# EAGLE design DietSquirt (EAGLE 7.1.0)
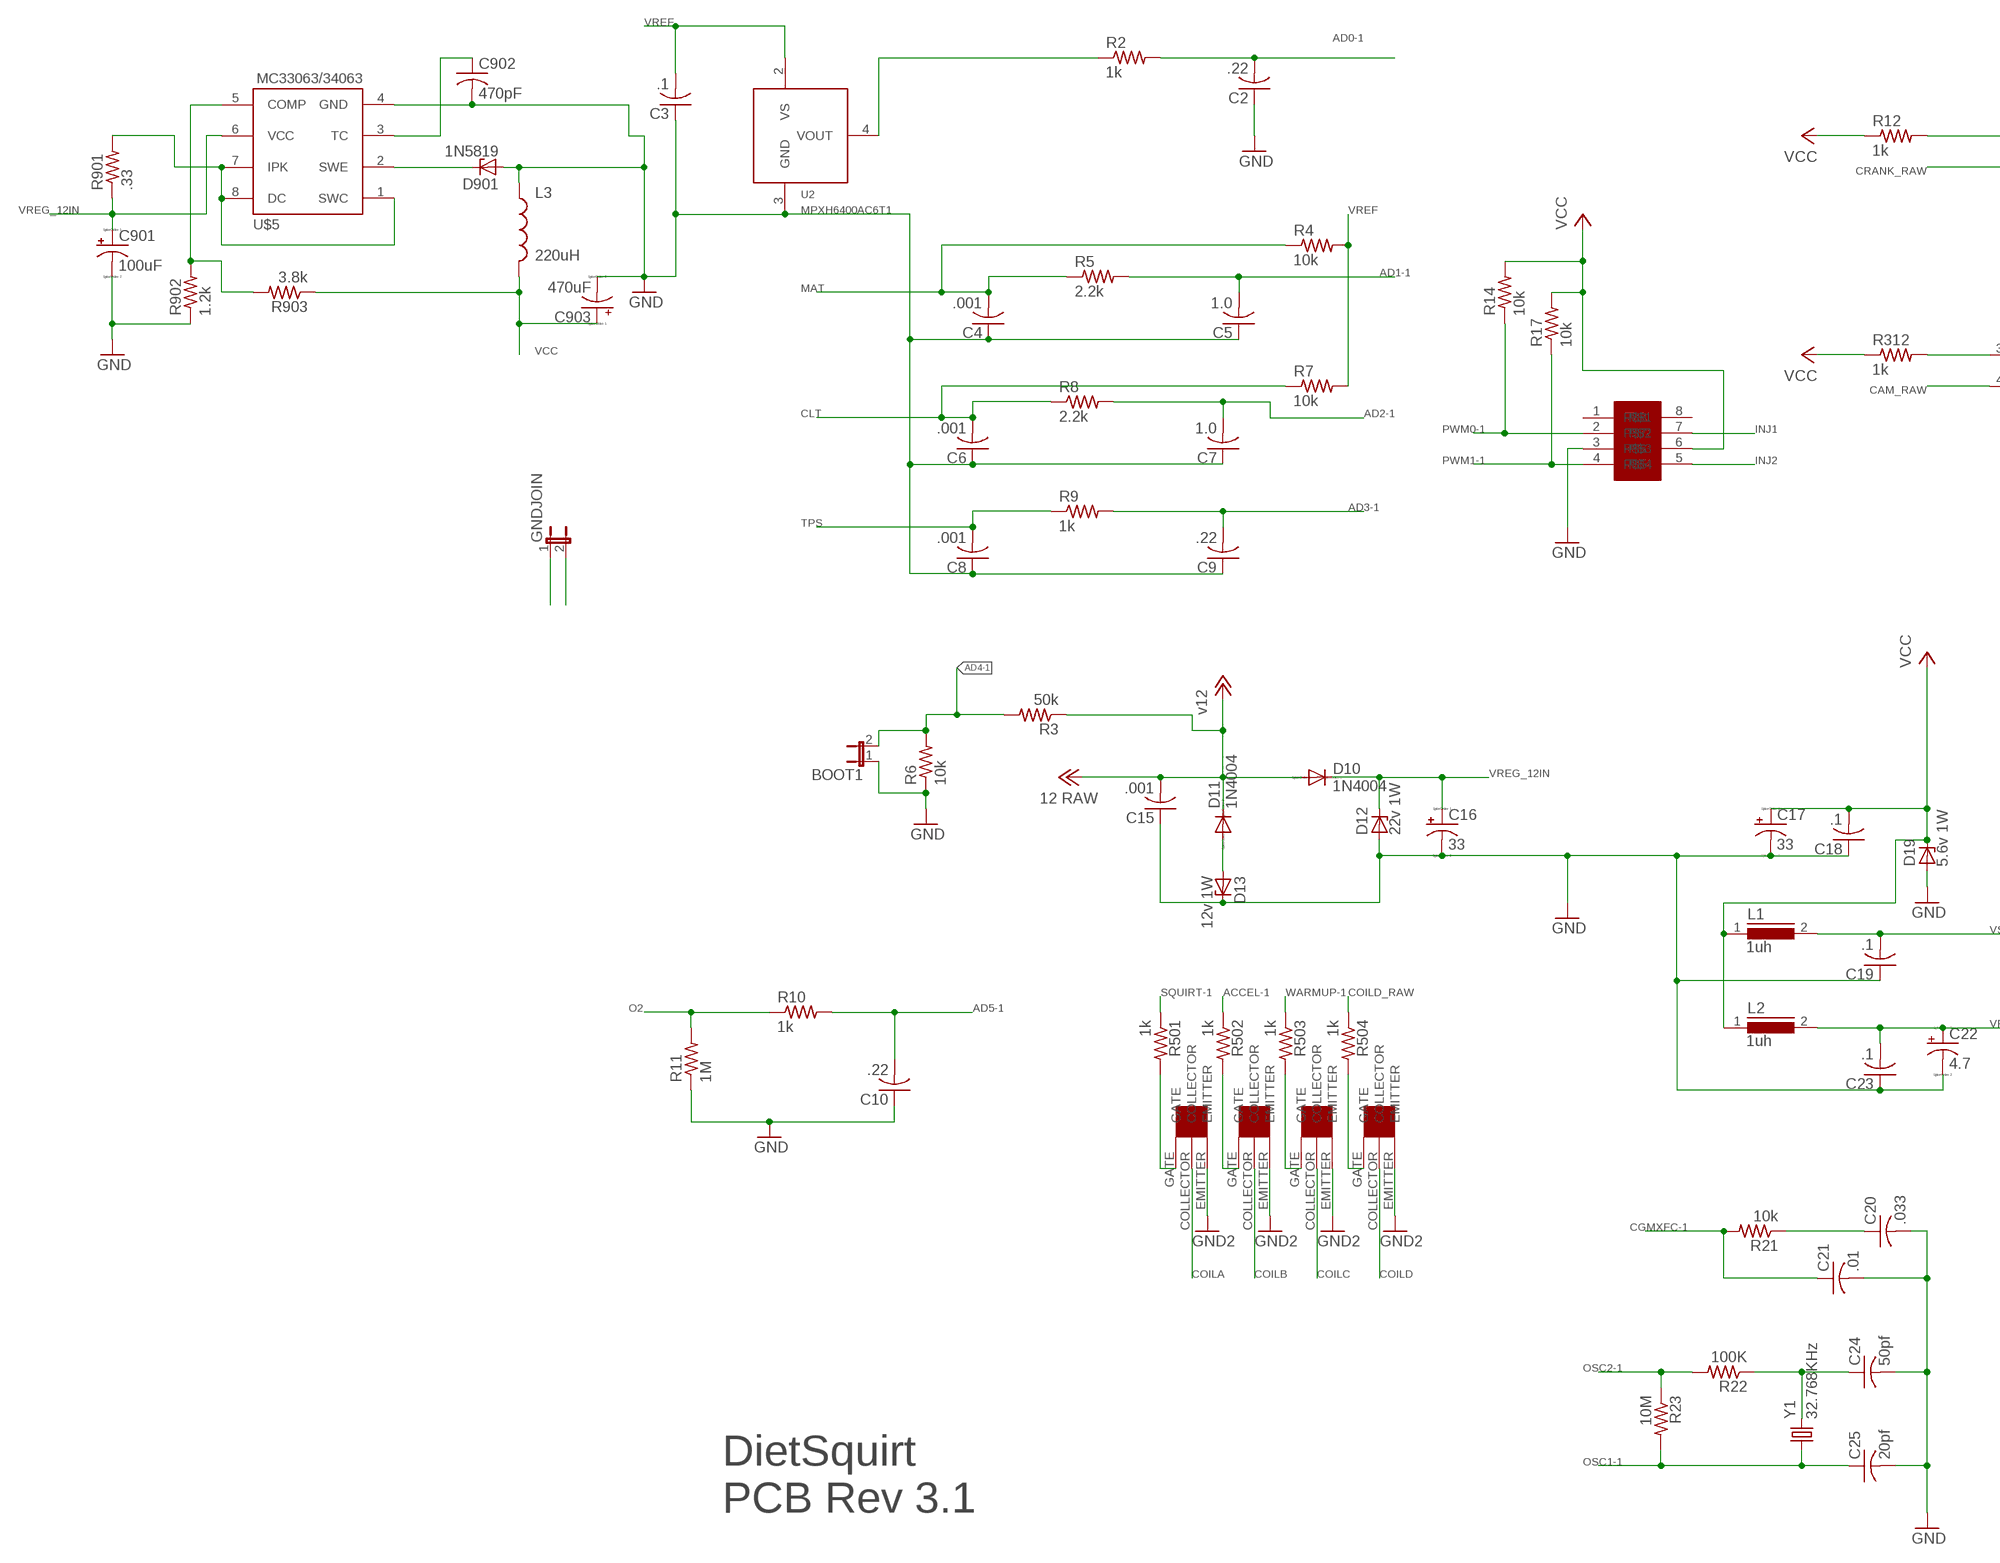
[diagram p0: schematic, sheet 1, part 1 of 2]
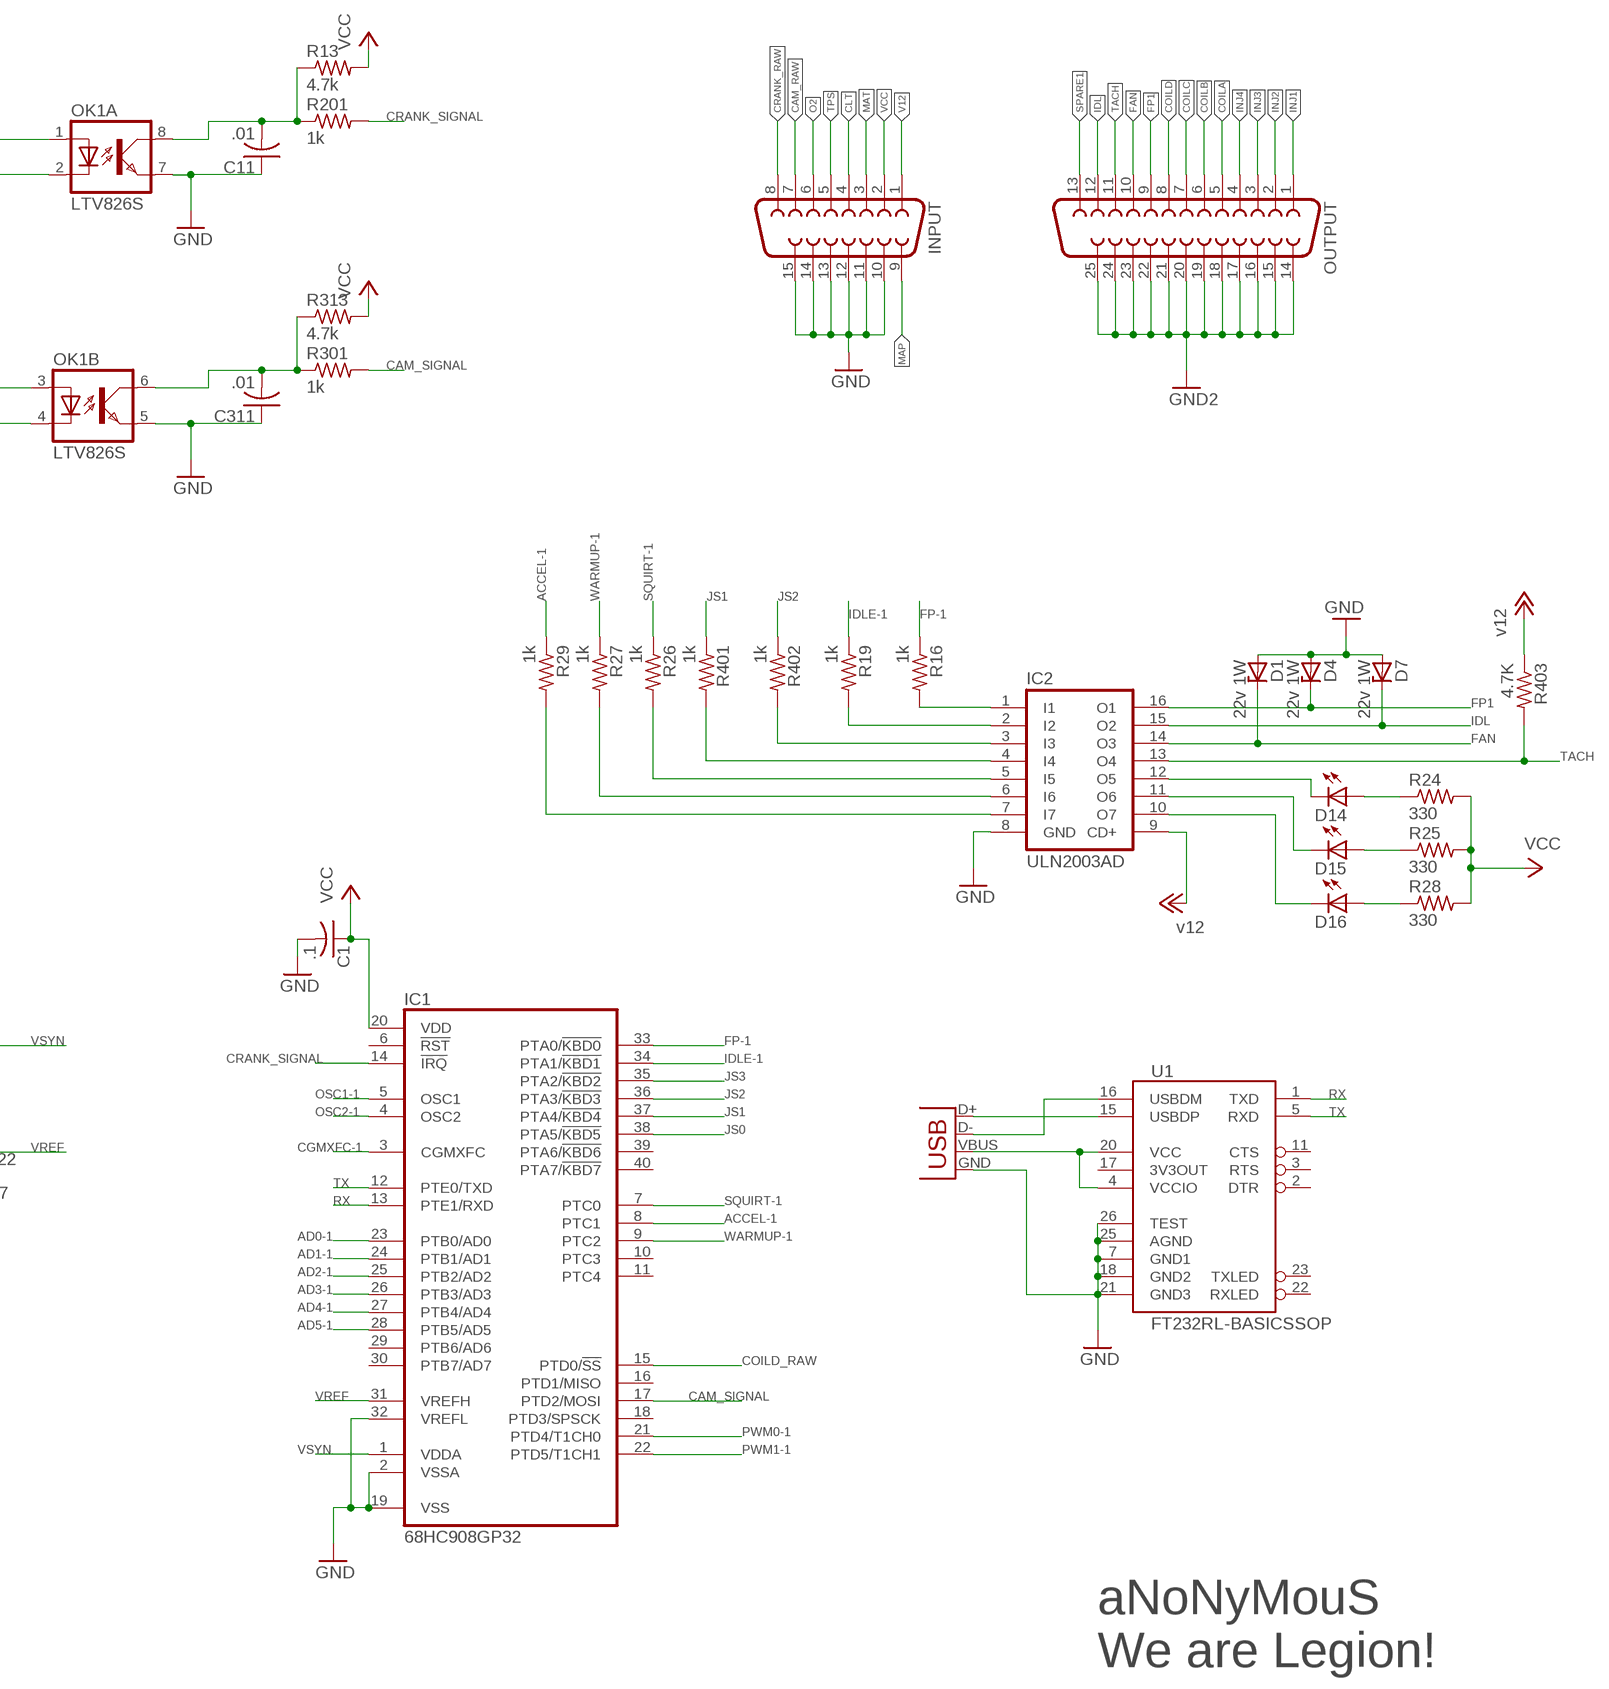
[diagram p1: schematic, sheet 1, part 2 of 2]

## Parts
BOOT1  JUMPER-2PTH  [1X02]
C1  .1  C-USC0805  [C0805]
C2  .22  C-USC0805  [C0805]
C3  .1  C-USC0805  [C0805]
C4  .001  C-USC0805  [C0805]
C5  1.0  C-USC0805  [C0805]
C6  .001  C-USC0805  [C0805]
C7  1.0  C-USC0805  [C0805]
C8  .001  C-USC0805  [C0805]
C9  .22  C-USC0805  [C0805]
C10  .22  C-USC0805  [C0805]
C11  .01  C-USC0805  [C0805]
C15  .001  C-USC0805  [C0805]
C16  33  CPOL-USC/6032-28R  [C/6032-28R]
C17  33  CPOL-USC/6032-28R  [C/6032-28R]
C18  .1  C-USC0805  [C0805]
C19  .1  C-USC0805  [C0805]
C20  .033  C-USC0805  [C0805]
C21  .01  C-USC0805  [C0805]
C22  4.7  CPOL-USC/6032-28R  [C/6032-28R]
C23  .1  C-USC0805  [C0805]
C24  50pf  C-USC0805  [C0805]
C25  20pf  C-USC0805  [C0805]
C311  .01  C-USC0805  [C0805]
C901  100uF  CPOL-USC/6032-28R  [C/6032-28R]
C902  470pF  C-USC0805  [C0805]
C903  470uF  CPOL-USC/6032-28R  [C/6032-28R]
COILA  ISL9V3036S3ST  [TO263]
COILB  ISL9V3036S3ST  [TO263]
COILC  ISL9V3036S3ST  [TO263]
COILD  ISL9V3036S3ST  [TO263]
D1  22v 1W  ZPY  [DO41Z10]
D4  22v 1W  ZPY  [DO41Z10]
D7  22v 1W  ZPY  [DO41Z10]
D10  1N4004  [DO41-10]
D11  1N4004  [DO41-10]
D12  22v 1W  ZPY  [DO41Z10]
D13  12v 1W  ZPY  [DO41Z10]
D14  LEDCHIPLED_0805  [CHIPLED_0805]
D15  LEDCHIPLED_0805  [CHIPLED_0805]
D16  LEDCHIPLED_0805  [CHIPLED_0805]
D19  5.6v 1W  ZPY  [DO41Z10]
D901  1N5819  ZPY  [DO41Z10]
GNDJOIN  JUMPER-2PTH  [1X02]
IC1  68HC908GP32  [DIL40]
IC2  ULN2003AD  [SO16]
INPUT  F15H  [F15H]
L1  1uh  MICC12  [MICC12]
L2  1uh  MICC12  [MICC12]
L3  220uH  INDUCTORNPI75  [NPI75C]
OK1  LTV826S  [DIL8-SMD]
OUTPUT  F25H  [F25H]
R2  1k  R-US_R0805  [R0805]
R3  50k  R-US_R0805  [R0805]
R4  10k  R-US_R0805  [R0805]
R5  2.2k  R-US_R0805  [R0805]
R6  10k  R-US_R0805  [R0805]
R7  10k  R-US_R0805  [R0805]
R8  2.2k  R-US_R0805  [R0805]
R9  1k  R-US_R0805  [R0805]
R10  1k  R-US_R0805  [R0805]
R11  1M  R-US_R0805  [R0805]
R12  1k  R-US_R0805  [R0805]
R13  4.7k  R-US_R0805  [R0805]
R14  10k  R-US_R0805  [R0805]
R16  1k  R-US_R0805  [R0805]
R17  10k  R-US_R0805  [R0805]
R19  1k  R-US_R0805  [R0805]
R21  10k  R-US_R0805  [R0805]
R22  100K  R-US_R0805  [R0805]
R23  10M  R-US_R0805  [R0805]
R24  330  R-US_R0805  [R0805]
R25  330  R-US_R0805  [R0805]
R26  1k  R-US_R0805  [R0805]
R27  1k  R-US_R0805  [R0805]
R28  330  R-US_R0805  [R0805]
R29  1k  R-US_R0805  [R0805]
R201  1k  R-US_R0805  [R0805]
R301  1k  R-US_R0805  [R0805]
R312  1k  R-US_R0805  [R0805]
R313  4.7k  R-US_R0805  [R0805]
R401  1k  R-US_R0805  [R0805]
R402  1k  R-US_R0805  [R0805]
R403  4.7K  R-US_R0805  [R0805]
R501  1k  R-US_R0805  [R0805]
R502  1k  R-US_R0805  [R0805]
R503  1k  R-US_R0805  [R0805]
R504  1k  R-US_R0805  [R0805]
R901  .33  R-US_R0805  [R0805]
R902  1.2k  R-US_R0805  [R0805]
R903  3.8k  R-US_R0805  [R0805]
U1  FT232RL-BASICSSOP  [SSOP28DB]
U2  MPXH6400AC6T1  [SSOP8]
U$1  MC34151  [SO08]
U$5  MC33063/MC34063D  [SO08]
X1  USB-MICROB  [USB-MICROB]
Y1  32.768KHz  CRYSTALTC26H  [TC26H]

## Nets
+12V: IC2.9(CD+) R403.1 ; supply symbol labelled v12
ACCEL-1: IC1.8(PTC1) R29.1 R502.1
AD0-1: C2.2 IC1.23(PTB0/AD0) R2.2
AD1-1: C5.2 IC1.24(PTB1/AD1) R5.2
AD2-1: C7.2 IC1.25(PTB2/AD2) R8.2
AD3-1: C9.2 IC1.26(PTB3/AD3) R9.2
AD4-1: BOOT1.2 IC1.27(PTB4/AD4) R3.2 R6.2
AD5-1: C10.2 IC1.28(PTB5/AD5) R10.2
CAM_RAW: INPUT.7 OK1.4(B:C)
CAM_SIGNAL: IC1.17(PTD2/MOSI) R301.2
CGMXFC-1: C21.1 IC1.3(CGMXFC) R21.2
CLT: C6.2 INPUT.4 R7.1 R8.1
COILA: COILA.COLLECTOR OUTPUT.5
COILB: COILB.COLLECTOR OUTPUT.6
COILC: COILC.COLLECTOR OUTPUT.7
COILD: COILD.COLLECTOR OUTPUT.8
COILD_RAW: IC1.15(PTD0/!SS) R504.1
CRANK_RAW: INPUT.8 OK1.2(A:C)
CRANK_SIGNAL: IC1.14(!IRQ) R201.2
FAN: D1.C IC2.14(O3) OUTPUT.10
FP1: D4.C IC2.16(O1) OUTPUT.9
FP-1: IC1.33(PTA0/!KBD0) R16.1
GND: BOOT1.1 C1.2 C2.1 C3.1 C4.1 C5.1 C6.1 C7.1 C8.1 C9.1 C10.1 C11.1 C15.1 C16.- C17.- C18.1 C19.1 C20.2 C21.2 C22.- C23.1 C24.2 C25.2 C311.1 C901.- C902.2 C903.- D1.A D4.A D7.A D12.A D13.C D19.A D901.A GNDJOIN.1 IC1.2(VSSA) IC1.19(VSS) IC1.32(VREFL) IC2.8(GND) INPUT.10 INPUT.11 INPUT.12 INPUT.13 INPUT.14 INPUT.15 L3.1 OK1.5(B:EMIT) OK1.7(A:EMIT) R6.1 R11.1 R902.1 U1.7(GND1) U1.18(GND2) U1.21(GND3) U1.25(AGND) U1.26(TEST) U2.3(GND) U$1.3 U$5.4(GND) X1.GND
GND2: COILA.EMITTER COILB.EMITTER COILC.EMITTER COILD.EMITTER GNDJOIN.2 OUTPUT.14 OUTPUT.15 OUTPUT.16 OUTPUT.17 OUTPUT.18 OUTPUT.19 OUTPUT.20 OUTPUT.21 OUTPUT.22 OUTPUT.23 OUTPUT.24 OUTPUT.25
IDL: D7.C IC2.15(O2) OUTPUT.12
IDLE-1: IC1.34(PTA1/!KBD1) R19.1
INJ1: OUTPUT.1 U$1.7
INJ2: OUTPUT.2 U$1.5
INJ3: OUTPUT.3
INJ4: OUTPUT.4
JS0: IC1.38(PTA5/!KBD5)
JS1: IC1.37(PTA4/!KBD4) R401.1
JS2: IC1.36(PTA3/!KBD3) R402.1
JS3: IC1.35(PTA2/!KBD2)
MAP: INPUT.9 R2.1 U2.4(VOUT)
MAT: C4.2 INPUT.3 R4.1 R5.1
N$1: C24.1 R22.1 Y1.2
N$2: OK1.1(A:A) R12.2
N$4: C20.1 R21.1
N$5: OK1.3(B:A) R312.2
N$6: D11.A D13.A
N$7: IC2.1(I1) R16.2
N$8: IC2.2(I2) R19.2
N$9: C11.2 OK1.8(A:COL) R13.1 R201.1
N$10: C311.2 OK1.6(B:COL) R301.1 R313.1
N$11: U1.4(VCCIO) U1.20(VCC) X1.VBUS
N$14: D901.C U$5.2(SWE)
N$15: IC2.3(I3) R402.2
N$16: U1.16(USBDM) X1.D-
N$17: U1.15(USBDP) X1.D+
N$18: IC2.4(I4) R401.2
N$19: IC2.5(I5) R26.2
N$20: IC2.6(I6) R27.2
N$21: IC2.7(I7) R29.2
N$22: D14.C IC2.12(O5)
N$23: D15.C IC2.11(O6)
N$24: D16.C IC2.10(O7)
N$25: D16.A R28.1
N$26: D15.A R25.1
N$27: D14.A R24.1
N$28: COILA.GATE R501.2
N$30: COILB.GATE R502.2
N$31: COILC.GATE R503.2
N$32: R901.2 U$5.1(SWC) U$5.7(IPK) U$5.8(DC)
N$34: R902.2 R903.2 U$5.5(COMP)
N$35: COILD.GATE R504.2
N$36: C902.1 U$5.3(TC)
O2: INPUT.6 R10.1 R11.2
OSC1-1: C25.1 IC1.5(OSC1) R23.2 Y1.1
OSC2-1: IC1.4(OSC2) R22.2 R23.1
PWM0-1: IC1.21(PTD4/T1CH0) R14.1 U$1.2
PWM1-1: IC1.22(PTD5/T1CH1) R17.1 U$1.4
RX: IC1.13(PTE1/RXD) U1.1(TXD)
SPARE1: OUTPUT.13
SQUIRT-1: IC1.7(PTC0) R26.1 R501.1
TACH: IC2.13(O4) OUTPUT.11 R403.2
TPS: C8.2 INPUT.5 R9.1
TX: IC1.12(PTE0/TXD) U1.5(RXD)
V12: C15.2 D10.A D11.C INPUT.1 R3.1 ; supply symbol labelled v12, 12 RAW
VCC: C1.1 C17.+ C18.2 C903.+ D19.C IC1.20(VDD) INPUT.2 L1.1 L2.1 L3.2 R12.1 R13.2 R14.2 R17.2 R24.2 R25.2 R28.2 R312.1 R313.2 R903.1 U$1.6
VREF: C3.2 C22.+ C23.2 IC1.31(VREFH) L2.2 R4.2 R7.2 U2.2(VS)
VREG_12IN: C16.+ C901.+ D10.C D12.C R901.1 U$5.6(VCC)
VSYN: C19.2 IC1.1(VDDA) L1.2
WARMUP-1: IC1.9(PTC2) R27.1 R503.1
Unconnected: IC1.6(!RST) IC1.10(PTC3) IC1.11(PTC4) IC1.16(PTD1/MISO) IC1.18(PTD3/SPSCK) IC1.29(PTB6/AD6) IC1.30(PTB7/AD7) IC1.39(PTA6/!KBD6) IC1.40(PTA7/!KBD7) U1.2(DTR) U1.3(RTS) U1.11(CTS) U1.17(3V3OUT) U1.22(RXLED) U1.23(TXLED) U2.1(NC) U2.5(NC) U2.6(NC) U2.7(NC) U2.8(NC) U$1.1 U$1.8

## Notes on the sheet
- aNoNyMouS
  We are Legion!
- DietSquirt
  PCB Rev 3.1

## Library data of the parts
BOOT1 GNDJOIN = SparkFun:JUMPER-2: Jumper Basic 0.1" spaced jumper. Use with breakaway headers.
C1-C11 C15 C18-C21 C23-C25 C311 C902 = resistor:C-US: CAPACITOR, American symbol
C16 C17 C22 C901 C903 = resistor:CPOL-US: POLARIZED CAPACITOR, American symbol
COILA COILB COILC COILD = IGBT:ISL9V3036S3ST
D1 D4 D7 D12 D13 D19 D901 = diode:ZPY: Z DIODE 1 W
D10 D11 = diode:1N4004: DIODE general purpose rectifier, 1 A
D14-D16 = adafruit:LED: LED OSRAM: - CHIPLED LG R971, LG N971, LY N971, LG Q971, LY Q971, LO R971, LY R971 LH N974, LH R974 LS Q976, LO Q976, LY Q976 LO Q996 - Hyper CHIPLED LW Q18S LB Q993, LB Q99A, LB R99A - SideLED LS A670, LO A670, LY A670, LG A670, LP A670 LB A673, LV A673, LT A673, LW A673 LH A674 LY A675 LS A676, LA A676, LO A676, LY A676, LW A676 LS A679, LY A679, LG A679 - Hyper Micro SIDELED® LS Y876, LA Y876, LO Y876, LY Y876 LT Y87S - SmartLED LW L88C, LW L88S LB L89C, LB L89S, LG L890 LS L89K, LO L89K, LY L89K LS L896, LA L896, LO L896, LY L896 - TOPLED LS T670, LO T670, LY T670, LG T670, LP T670 LSG T670, LSP T670, LSY T670, LOP T670, LYG T670 LG T671, LOG T671, LSG T671 LB T673, LV T673, LT T673, LW T673 LH T674 LS T676, LA T676, LO T676, LY T676, LB T676, LH T676, LSB T676, LW T676 LB T67C, LV T67C, LT T67C, LS T67K, LO T67K, LY T67K, LW E67C LS E67B, LA E67B, LO E67B, LY E67B, LB E67C, LV E67C, LT E67C LW T67C LS T679, LY T679, LG T679 LS T770, LO T770, LY T770, LG T770, LP T770 LB T773, LV T773, LT T773, LW T773 LH T774 LS E675, LA E675, LY E675, LS T675 LS T776, LA T776, LO T776, LY T776, LB T776 LHGB T686 LT T68C, LB T68C - Hyper Mini TOPLED® LB M676 - Mini TOPLED Santana® LG M470 LS M47K, LO M47K, LY M47K Source: http://www.osram.convergy.de/
IC1 = micro-motorola:68HC908GP32*: MC68HC908GP32 MC68HC08GP32 Source: www.motorola.com .. MC68HC908GP32.pdf; MF: MOTOROLA; MPN: MC68HC908GP32CP; OC_FARNELL: 1200519; OC_NEWARK: 95B4407
IC2 = uln-udn:ULN2003A: DRIVER ARRAY
INPUT = con-subd:F15: SUB-D; OC_FARNELL: unknown; OC_NEWARK: unknown
L1 L2 = inductors:MICC12: INDUCTOR
L3 = SparkFun:INDUCTOR: Inductors Basic Inductor/Choke - 0603 and 1206. Footprints are not proven and vary greatly between part numbers.
OK1 = optocoupler:LTV826: OPTO COUPLER Source: LITEON, LTV816.pdf; OC_FARNELL: unknown; OC_NEWARK: unknown
OUTPUT = con-subd:F25: SUB-D; OC_FARNELL: unknown; OC_NEWARK: unknown
R2-R14 R16 R17 R19 R21-R29 R201 R301 R312 R313 R401-R403 R501-R504 R901-R903 = rcl:R-US_: RESISTOR, American symbol
U1 = SparkFun:FT232RL-BASIC: USB UART This is the simplified version of the FT232RL unit. Only what you need, nothing you don't. Spark Fun Electronics SKU : COM-00650
U2 = mpxh6400:MPXH6400A
U$1 = mc34151:MC34151
U$5 = adafruit:MC33063/MC34063: MC33063 and MC34063 Basic DC/DC converter with internal power-NPN transistor, 100KHz, 1.5A peak switch current. 3-40 input/output.
X1 = SparkFun:USB: USB Connectors USB-B-PTH is fully proven SKU : PRT-00139 USB-miniB is fully proven SKU : PRT-00587 USB-A-PCB is untested. USB-A-H is throughly reviewed, but untested. Spark Fun Electronics SKU : PRT-00437 USB-B-SMT is throughly reviewed, but untested. Needs silkscreen touching up. USB-A-S has not been used/tested USB-MB-H has not been used/tested
Y1 = crystal:CRYSTAL: CRYSTAL; OC_FARNELL: unknown; OC_NEWARK: unknown

## Board
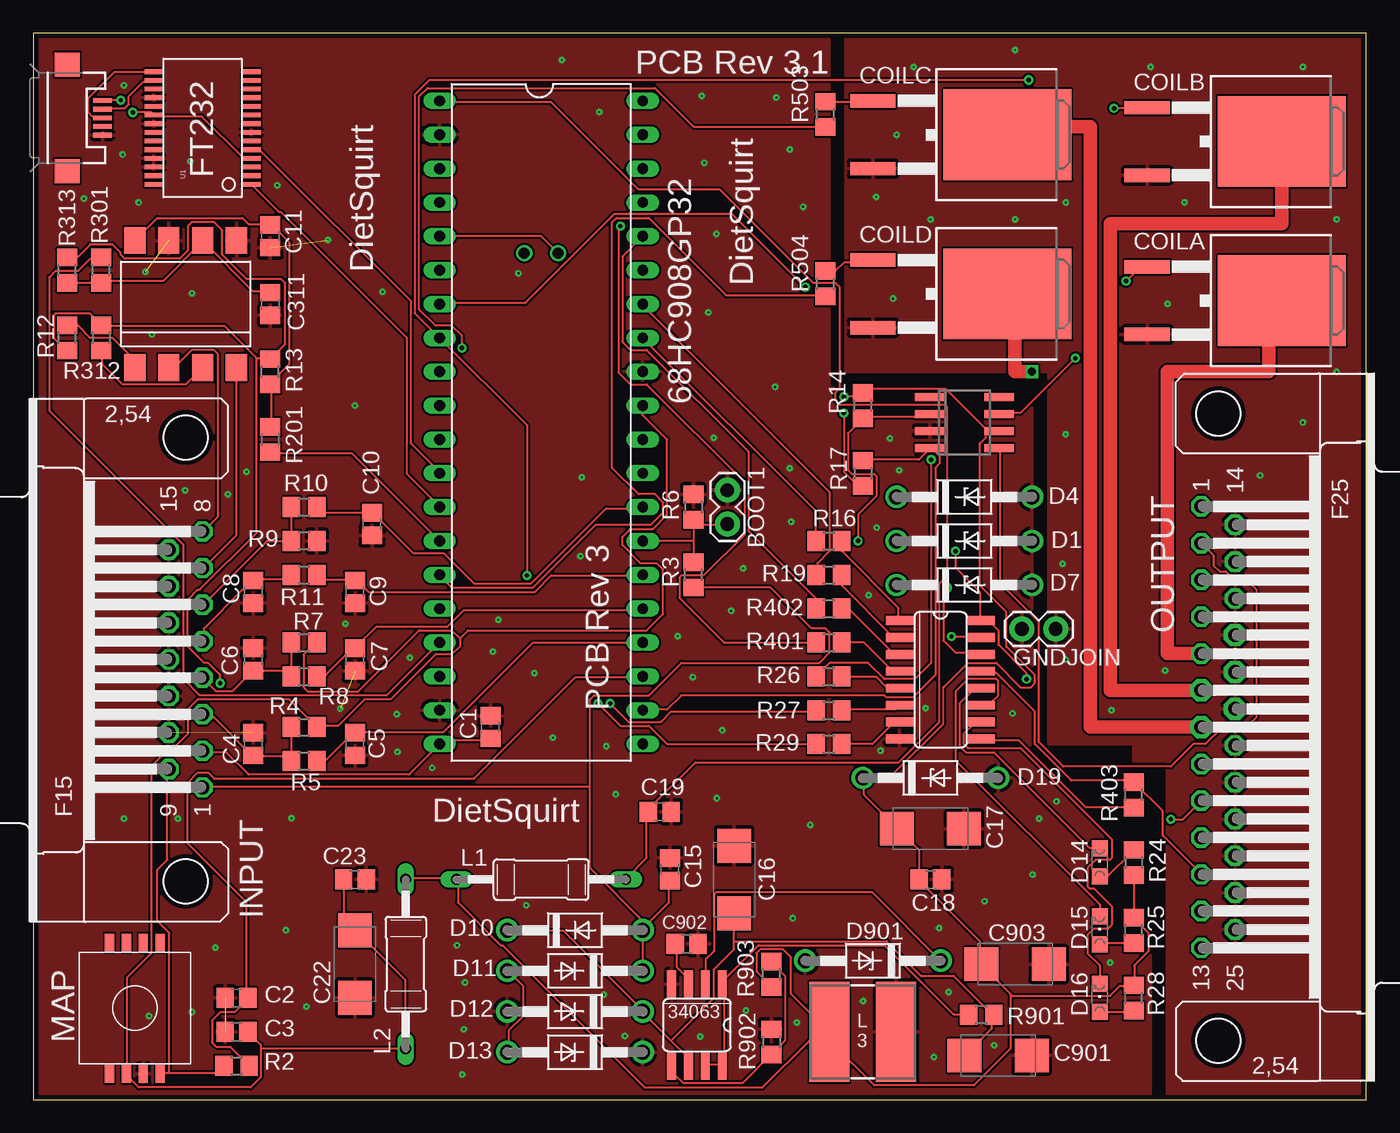
[diagram p2: board, top side]
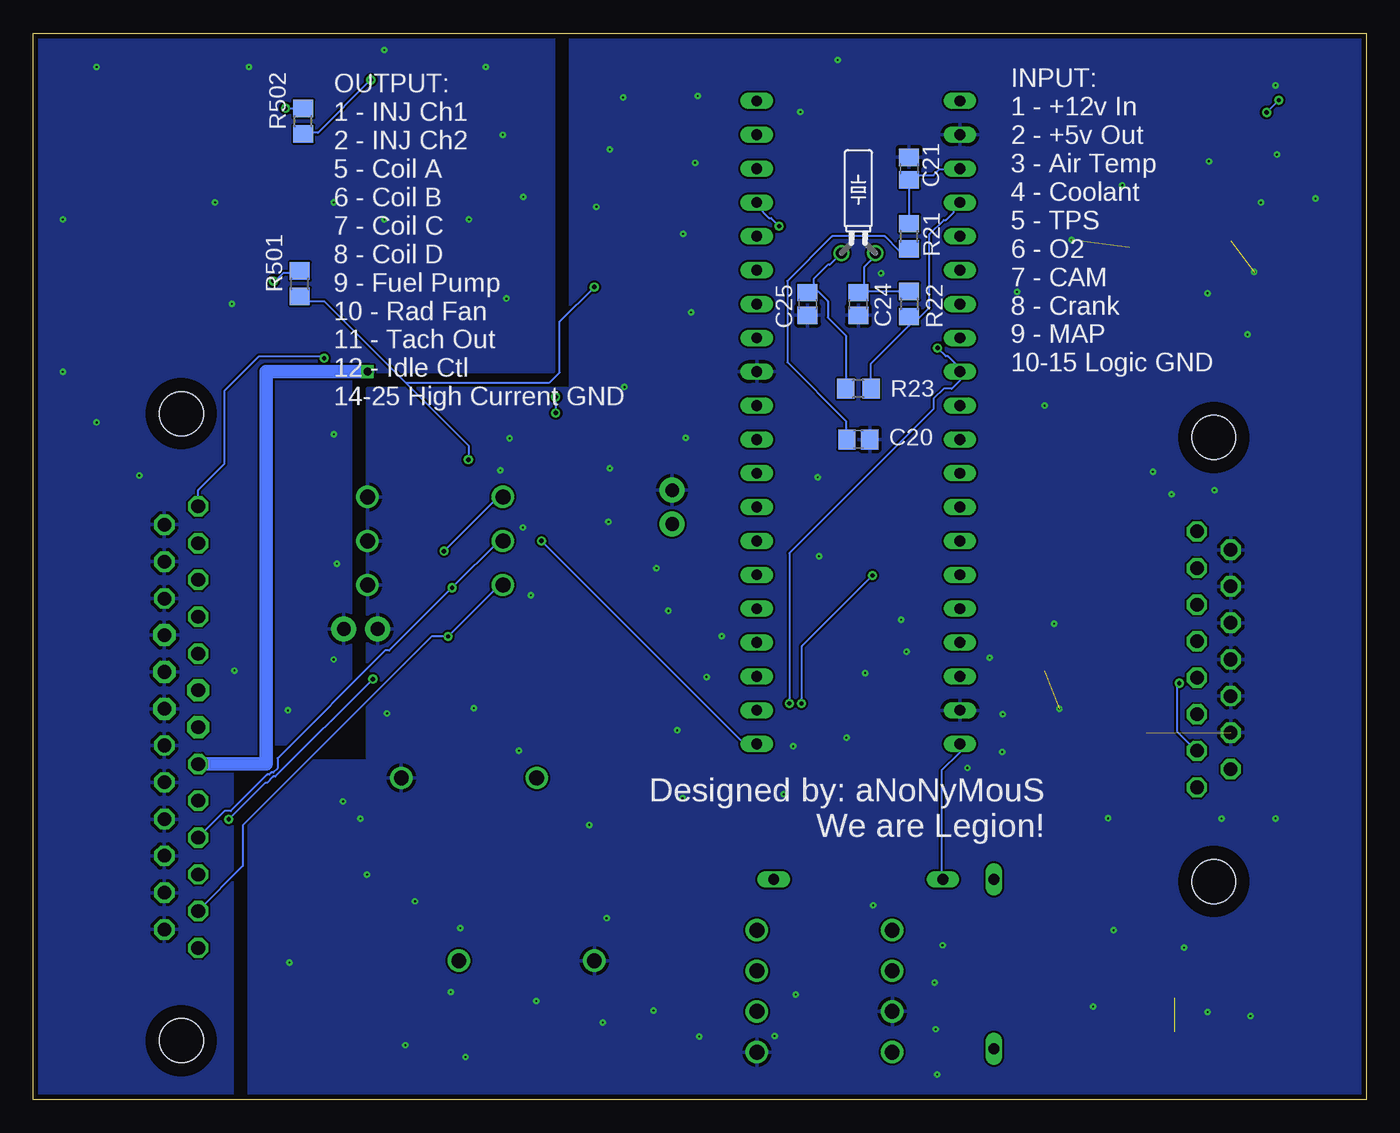
[diagram p3: board, bottom side, seen from below]

Size 100 x 80 mm. Coordinates in mm from the lower left corner, seen from the top.
Outline: 0,0 100,0 100,80 0,80 0,0
Copper layers (1*16): Top 0.0356mm / dielectric 1.5011mm / Bottom 0.0356mm
Design rules "oshpark-2layer *": minimum track width 6mil, minimum drill 13mil, track to track 6mil, track to pad 6mil, pad to pad 6mil, via to via 6mil, smd to smd 6mil, copper to edge 15mil, drill to drill 6mil, minimum pad ring 7mil, minimum via ring 7mil, stop-mask expansion 3mil, vias tented up to drill 25mil, thermal gap 10mil

### Footprints (pad centres in the part's own frame; a part is rotated, then mirrored left to right if it is on the bottom)
1X02 = drill 1.016 pad 1.88: 1 0,0; 2 2.54,0
C0805 = smd 1.3 x 1.5: 1 -0.85,0; 2 0.85,0
C/6032-28R = smd 2.55 x 2.5: + 2.525,0; - -2.525,0
TO263 = smd 6.8 x 9.6: COLLECTOR 0,3.5 | smd 1 x 3.4: EMITTER 2.54,-6.6; GATE -2.54,-6.6
DO41Z10 = drill 1.118: A 5.08,0; C -5.08,0
DO41-10 = drill 1.118: A 5.08,0; C -5.08,0
CHIPLED_0805 = smd 1.2 x 1.2: A 0,-1.05; C 0,1.05
DIL40 = drill 0.813 long: 1 -24.13,-7.62; 2 -21.59,-7.62; 3 -19.05,-7.62; 4 -16.51,-7.62; 5 -13.97,-7.62; 6 -11.43,-7.62; 7 -8.89,-7.62; 8 -6.35,-7.62; 9 -3.81,-7.62; 10 -1.27,-7.62; 11 1.27,-7.62; 12 3.81,-7.62; 13 6.35,-7.62; 14 8.89,-7.62; 15 11.43,-7.62; 16 13.97,-7.62; 17 16.51,-7.62; 18 19.05,-7.62; 19 21.59,-7.62; 20 24.13,-7.62; 21 24.13,7.62; 22 21.59,7.62; 23 19.05,7.62; 24 16.51,7.62; 25 13.97,7.62; 26 11.43,7.62; 27 8.89,7.62; 28 6.35,7.62; 29 3.81,7.62; 30 1.27,7.62; 31 -1.27,7.62; 32 -3.81,7.62; 33 -6.35,7.62; 34 -8.89,7.62; 35 -11.43,7.62; 36 -13.97,7.62; 37 -16.51,7.62; 38 -19.05,7.62; 39 -21.59,7.62; 40 -24.13,7.62
SO16 = smd 0.66 x 2.032: 1 -4.445,-3.073; 2 -3.175,-3.073; 3 -1.905,-3.073; 4 -0.635,-3.073; 5 0.635,-3.073; 6 1.905,-3.073; 7 3.175,-3.073; 8 4.445,-3.073; 9 4.445,3.073; 10 3.175,3.073; 11 1.905,3.073; 12 0.635,3.073; 13 -0.635,3.073; 14 -1.905,3.073; 15 -3.175,3.073; 16 -4.445,3.073
F15H = drill 1.016 octagon: 1 -9.601,-1.27; 2 -6.858,-1.27; 3 -4.115,-1.27; 4 -1.372,-1.27; 5 1.372,-1.27; 6 4.115,-1.27; 7 6.858,-1.27; 8 9.601,-1.27; 9 -8.23,1.27; 10 -5.486,1.27; 11 -2.743,1.27; 12 0,1.27; 13 2.743,1.27; 14 5.486,1.27; 15 8.23,1.27 | hole 3.302: -16.662,0; 16.662,0
MICC12 = drill 0.813 long: 1 -6.35,0; 2 6.35,0
NPI75C = smd 3 x 7.5: 1 -2.5,0; 2 2.5,0
DIL8-SMD = smd 1.6 x 2: 1 -3.81,-4.77; 2 -1.27,-4.77; 3 1.27,-4.77; 4 3.81,-4.77; 5 3.81,4.77; 6 1.27,4.77; 7 -1.27,4.77; 8 -3.81,4.77
F25H = drill 1.016 octagon: 1 -16.561,-1.27; 2 -13.792,-1.27; 3 -11.049,-1.27; 4 -8.28,-1.27; 5 -5.512,-1.27; 8 2.769,-1.27; 9 5.512,-1.27; 10 8.28,-1.27; 11 11.049,-1.27; 12 13.792,-1.27; 13 16.561,-1.27; 14 -15.189,1.27; 15 -12.421,1.27; 16 -9.652,1.27; 20 1.372,1.27; 21 4.14,1.27; 22 6.909,1.27; 23 9.652,1.27; 24 12.421,1.27; 25 15.189,1.27 | drill 1.016 pad 1.67 octagon: 6 -2.769,-1.27; 7 0,-1.27; 17 -6.909,1.27; 18 -4.14,1.27; 19 -1.372,1.27 | hole 3.302: -23.52,0; 23.52,0
R0805 = smd 1.3 x 1.5: 1 -0.95,0; 2 0.95,0
SSOP28DB = smd 0.348 x 1.397: 1 -4.225,-3.656; 2 -3.575,-3.656; 3 -2.925,-3.656; 4 -2.275,-3.656; 5 -1.625,-3.656; 6 -0.975,-3.656; 7 -0.325,-3.656; 8 0.325,-3.656; 9 0.975,-3.656; 10 1.625,-3.656; 11 2.275,-3.656; 12 2.925,-3.656; 13 3.575,-3.656; 14 4.225,-3.656; 15 4.225,3.656; 16 3.575,3.656; 17 2.925,3.656; 18 2.275,3.656; 19 1.625,3.656; 20 0.975,3.656; 21 0.325,3.656; 22 -0.325,3.656; 23 -0.975,3.656; 24 -1.625,3.656; 25 -2.275,3.656; 26 -2.925,3.656; 27 -3.575,3.656; 28 -4.225,3.656
SSOP8 = smd 1.346 x 0.686: 1 4.915,-1.905; 2 4.915,-0.635; 3 4.915,0.635; 4 4.915,1.905; 5 -4.915,1.905; 6 -4.915,0.635; 7 -4.915,-0.635; 8 -4.915,-1.905
SO08 = smd 0.6 x 2.2: 1 -1.905,-2.6; 2 -0.635,-2.6; 3 0.635,-2.6; 4 1.905,-2.6; 5 1.905,2.6; 6 0.635,2.6; 7 -0.635,2.6; 8 -1.905,2.6
SO08' = smd 0.66 x 2.032: 1 -1.905,-3.073; 2 -0.635,-3.073; 3 0.635,-3.073; 4 1.905,-3.073; 5 1.905,3.073; 6 0.635,3.073; 7 -0.635,3.073; 8 -1.905,3.073
USB-MICROB = smd 0.35 x 1.4: D+ 0,2.65; D- -0.65,2.65; GND 1.3,2.65; ID 0.65,2.65; VBUS -1.3,2.65 | smd 1.8 x 1.9: MT1 -4,0; MT2 4,0
TC26H = drill 0.813: 1 -1.27,0; 2 1.27,0

### Placement (x,y rotation side)
BOOT1  52.07,45.72 270 top
C1  34.29,27.94 90 top
C2  15.24,7.62 0 top
C3  15.24,5.08 0 top
C4  16.51,26.67 270 top
C5  24.13,26.67 90 top
C6  16.51,33.02 270 top
C7  24.13,33.02 90 top
C8  16.51,38.1 90 top
C9  24.13,38.1 90 top
C10  25.4,43.18 90 top
C11  17.78,64.77 90 top
C15  47.75,17.27 270 top
C16  52.58,16.51 270 top
C17  67.31,20.32 180 top
C18  67.31,16.51 180 top
C19  46.99,21.59 180 top
C20  38.1,49.53 0 bottom
C21  34.29,69.85 90 bottom
C22  24.13,10.16 90 top
C23  24.13,16.51 180 top
C24  38.1,59.69 270 bottom
C25  41.91,59.69 270 bottom
C311  17.78,59.69 90 top
C901  72.39,3.3 180 top
C902  49.02,11.68 0 top
C903  73.66,10.16 180 top
COILA  90.17,59.94 270 top
COILB  90.17,71.88 270 top
COILC  69.6,72.39 270 top
COILD  69.6,60.45 270 top
D1  69.85,41.91 0 top
D4  69.85,45.21 0 top
D7  69.85,38.61 0 top
D10  40.64,12.7 0 top
D11  40.64,9.65 180 top
D12  40.64,6.6 180 top
D13  40.64,3.56 180 top
D14  80.01,17.78 0 top
D15  80.01,12.7 0 top
D16  80.01,7.62 0 top
D19  67.31,24.13 0 top
D901  62.99,10.41 180 top
GNDJOIN  74.17,35.31 0 top
IC1  38.1,50.8 270 top
IC2  68.07,31.5 270 top
INPUT  11.43,33.02 90 top
L1  38.1,16.51 0 top
L2  27.94,10.16 270 top
L3  62.23,5.08 180 top
OK1  11.43,59.69 0 top
OUTPUT  88.9,27.94 270 top
R2  15.24,2.54 0 top
R3  49.53,39.37 90 top
R4  20.32,27.94 0 top
R5  20.32,25.4 0 top
R6  49.53,44.45 270 top
R7  20.32,34.29 0 top
R8  20.32,31.75 0 top
R9  20.32,39.37 0 top
R10  20.32,44.45 0 top
R11  20.32,41.91 180 top
R12  2.54,57.15 90 top
R13  17.78,54.61 90 top
R14  62.23,52.07 90 top
R16  59.69,41.91 0 top
R17  62.23,46.99 270 top
R19  59.69,39.37 0 top
R21  34.29,64.77 90 bottom
R22  34.29,59.69 270 bottom
R23  38.1,53.34 180 bottom
R24  82.55,17.78 270 top
R25  82.55,12.7 90 top
R26  59.69,31.75 0 top
R27  59.69,29.21 0 top
R28  82.55,7.62 90 top
R29  59.69,26.67 0 top
R201  17.78,49.53 270 top
R301  5.08,62.23 90 top
R312  5.08,57.15 270 top
R313  2.54,62.23 90 top
R401  59.69,34.29 0 top
R402  59.69,36.83 0 top
R403  82.55,22.86 90 top
R501  80.01,61.21 90 bottom
R502  79.76,73.41 90 bottom
R503  59.44,73.91 90 top
R504  59.44,61.21 90 top
R901  71.12,6.35 180 top
R902  55.37,4.32 270 top
R903  55.37,9.4 90 top
U1  12.7,72.9 90 top
U2  7.62,6.86 270 top
U$1  69.85,50.8 270 top
U$5  MC33063/MC34063D  [SO08']  49.78,5.59 180 top
X1  2.54,73.66 270 top
Y1  38.1,63.5 0 bottom

### Tracks (layer width: path | path; a pad name or v marks a point on that pad's centre or on a via)
+12V
  Top 0.152: R403.1 82.45,21.95 78.94,21.95 73.91,26.98 71.17,26.98 IC2.9
ACCEL-1  (via drill 0.33)
  Top 0.152: R29.1 47.55,26.67 46.18,28.04 44.04,28.04 v42.37,29.72 | v37.03,39.32 37.03,50.6 IC1.8 28.65,58.98 28.65,75.44 29.72,76.5 v74.68,76.5
  Bottom 0.152: v42.37,29.72 42.37,33.98 v37.03,39.32 | v74.68,76.5 78.64,72.54 79.7,72.54 R502.1
AD0-1
  Top 0.152: R2.2 16.15,2.59 14.78,3.96 13.72,3.96 13.41,4.27 13.41,5.94 14.02,6.55 15.09,6.55 16.15,7.62 C2.2 16,7.62 16,14.78 11.58,19.2 11.58,23.77 12.34,24.54 13.11,24.54 13.56,24.08 33.07,24.08 40.69,31.7 45.72,31.7 IC1.23
AD1-1
  Top 0.152: R5.2 21.34,25.45 21.95,25.45 24.08,27.58 C5.2 24.23,27.58 30.79,27.58 37.49,34.29 IC1.24
AD2-1
  Top 0.152: R8.2 21.34,31.85 21.95,31.85 24.08,33.98 C7.2 24.23,33.98 25.76,35.51 31.09,35.51 32.31,36.73 45.72,36.73 IC1.25
AD3-1
  Top 0.152: R9.2 21.34,39.32 21.64,39.01 24.08,39.01 C9.2 24.23,39.01 25.15,38.1 37.64,38.1 38.86,39.32 45.72,39.32 IC1.26
AD4-1
  Top 0.152: R6.2 49.53,43.13 | 49.53,43.13 49.53,41.91 | 49.53,41.91 R3.2 | 49.53,41.91 IC1.27 | 49.53,43.13 51.97,43.13 BOOT1.2
AD5-1
  Top 0.152: R10.2 21.34,44.35 21.64,44.04 25.3,44.04 C10.2 25.45,44.04 28.5,41 30.79,41 33.07,38.71 37.34,38.71 42.98,44.35 45.72,44.35 IC1.28
CAM_RAW
  Top 0.152: OK1.4 15.24,42.37 12.8,39.93 INPUT.7
CAM_SIGNAL
  Top 0.152: IC1.17 26.52,30.33 12.5,30.33 11.28,31.55 11.28,41.6 1.22,51.66 1.22,61.72 1.68,62.18 3.35,62.18 4.27,63.09 5.03,63.09 R301.2
CGMXFC-1
  Bottom 0.152: R21.2 C21.1 34.29,69.04 33.98,69.34 32.46,69.34 32,69.8 30.48,69.8 IC1.3
CLT
  Top 0.152: 19.36,32.16 19.36,34.29 R7.1 | 19.36,32.16 19.36,31.85 R8.1 19.36,32.16 | 19.36,32.16 16.61,32.16 C6.2 16.46,32.16 14.94,30.63 13.72,30.63 INPUT.4
COILA
  Top 1.016: OUTPUT.5 85.09,33.45 85.09,54.61 92.71,54.61 92.71,59.69 95.25,59.69 95.25,60.96 93.67,60.96 COILA.COLLECTOR
COILB
  Top 1.016: OUTPUT.6 80.8,30.71 80.8,65.7 93.67,65.7 COILB.COLLECTOR
COILC
  Top 1.016: OUTPUT.7 79.3,27.94 79.3,73 73.1,73 COILC.COLLECTOR
COILD  (via drill 0.6)
  Top 1.016: v74.93,54.61 73.66,54.61 73.66,60.96 73.1,60.96 COILD.COLLECTOR
  Bottom 1.016: OUTPUT.8 82.55,25.17 82.55,54.61 v74.93,54.61
COILD_RAW
  Top 0.152: R504.1 59.44,60.35 51.97,60.35 46.18,66.14 43.74,66.14 43.43,65.84 43.43,47.4 45.41,45.41 46.63,45.41 47.24,44.81 47.24,44.04 46.33,43.13 42.22,43.13 37.49,38.41 31.39,38.41 30.48,39.32 IC1.15
CRANK_RAW
  Top 0.152: OK1.2 10.21,55.02 10.67,55.02 11.89,56.24 13.56,56.24 13.87,55.93 13.87,43.74 12.8,42.67 INPUT.8
CRANK_SIGNAL
  Top 0.152: IC1.14 23.93,48.46 17.83,48.46 R201.2
FAN  (via drill 0.33)
  Top 0.152: v68.58,38.41 68.28,38.1 68.28,34.44 69.19,33.53 71.02,33.53 IC2.14
  Bottom 0.152: D1.C 65.08,41.91 v68.58,38.41 73.3,33.68 73.61,33.68 81.69,25.6 81.69,24.84 81.99,24.54 82.14,24.54 82.3,24.38 82.45,24.38 85.19,21.64 85.65,21.64 OUTPUT.10
FP1  (via drill 0.33)
  Top 0.152: v69.19,41.15 69.19,39.93 71.02,38.1 71.02,35.97 IC2.16 71.17,35.81 71.78,35.81 72.39,35.2 72.39,34.14 74.52,32 v74.52,31.55 | v85.34,21.03 86.26,21.03 87.63,22.4 OUTPUT.9
  Bottom 0.152: v69.19,41.15 65.23,45.11 64.77,45.11 D4.C | v85.34,21.03 82.6,23.77 82.45,23.77 81.99,24.23 81.84,24.23 v74.52,31.55
FP-1
  Top 0.152: IC1.33 58.67,44.2 58.67,41.91 R16.1
GND  (via drill 0.13)  (5 unrouted)
  other vias: 24.13,52.07 16,47.1 14.59,45.41 11.39,45.71 41.16,46.69 23.42,35.7 28.26,33.14 23.02,29.32 27.26,28.91 34.49,33.6 34.89,36 37.59,32 38.99,27.15 27.32,26.08 29.92,24.88 10.84,21.08 6.81,21.09 19.36,21.1 18.96,12.7 13.66,11.4 8.69,6.27 11.89,6.57 20.49,6.97 32.19,1.87 32.29,5.27 32.39,8.77 31.79,11.57 36.99,14.57 42.79,7.87 44.39,4.77 44.39,4.77 56.99,13.6 58.29,20.6 51.29,22.6 43.69,22.9 42.99,26.5 51.69,27.7 49.49,31.7 53.47,6.68 57.27,5.78 62.27,7.38 67.57,3.18 71.36,14.87 67.96,12.87 74.96,16.87 75.46,21.07 76.76,22.37 73.46,28.97 63.56,26.17 66.96,29.37 52.35,36.66 41.05,40.76 53.25,39.86 56.85,43.36 56.75,47.36 51.05,49.66 55.65,53.46 50.65,59.06 51.25,64.96 42.45,74.09 50.35,70.29 57.75,66.99 56.75,71.29 55.75,75.19 50.15,75.29 39.65,77.99 64.27,49.62 64.97,47.22 63.27,42.92 62.67,37.84 48.35,34.76 11.9,60.5 8.4,62.1 7.9,67.3 3.8,67.6 6.7,70.9 6.7,70.9 11.8,70.4 18.3,68.6 26.2,60.6 6.8,76.1 8.9,57.4 36.4,62 22.1,64.5 80.78,10.27 68.68,8.07 72.08,4.07 50.04,4.73
  pour Bottom: 0,80.01 59.69,80.01 59.69,53.34 74.93,53.34 74.93,25.4 81.28,25.4 81.28,24.13 83.82,24.13 83.82,0 0,0
  pour Top: 0,80.01 59.69,80.01 59.69,53.34 74.93,53.34 74.93,25.4 81.28,25.4 81.28,24.13 83.82,24.13 83.82,0 0,0
GND2  (via drill 0.13)
  other vias: 64.5,60.1 63.23,67.72 64.77,72.39 67.31,66.04 73.66,66.04 77.47,67.31 66.04,77.47 73.66,78.74 83.82,77.47 95.25,77.47 86.36,67.31 85.09,59.69 97.79,66.04 97.79,54.61 95.25,50.8 77.47,33.02 80.9,29.2 84.92,32.19 77.22,40.19 77.45,49.92 92.05,46.82
  pour Top: 60.96,80.01 100.33,80.01 100.33,0 85.09,0 85.09,25.4 82.55,25.4 82.55,26.67 76.2,26.67 76.2,54.61 60.96,54.61
  pour Bottom: 60.96,80.01 100.33,80.01 100.33,0 85.09,0 85.09,25.4 82.55,25.4 82.55,26.67 76.2,26.67 76.2,54.61 60.96,54.61
IDL  (via drill 0.33)
  Top 0.152: v68.89,34.75 71.02,34.75 IC2.15
  Bottom 0.152: D7.C 64.77,38.56 65.08,38.56 v68.89,34.75 70.1,34.75 84.28,20.57 84.28,17.53 87.63,14.17 OUTPUT.12
IDLE-1
  Top 0.152: R19.1 58.83,39.47 58.83,40.23 59.74,41.15 59.74,45.57 45.72,59.59 IC1.34
INJ1  (via drill 0.33)
  Top 0.152: v78.18,55.63 74.07,51.51 72.54,51.51 U$1.7
  Bottom 0.152: v78.18,55.63 78.33,55.78 83.06,55.78 85.65,53.19 85.65,47.7 87.63,45.72 OUTPUT.1
INJ2
  Top 0.152: U$1.5 72.54,48.77 72.54,38.71 75.44,35.81 75.44,26.82 77.27,24.99 85.34,24.99 87.02,26.67 87.94,26.67 89.15,27.89 89.31,27.89 89.61,28.19 90.68,28.19 90.98,27.89 91.75,28.65 91.75,38.25 90.68,39.32 89.76,39.32 89.46,39.62 89,39.62 88.54,40.08 88.54,40.84 87.63,41.76 OUTPUT.2
JS1  (via drill 0.33)
  Top 0.152: R401.1 51.82,34.29 48.46,37.64 48.46,39.17 48.62,39.32 50.29,39.32 53.34,42.37 53.34,46.33 46.02,53.65 44.81,53.65 43.89,54.56 43.89,65.38 v44.04,65.53
  Bottom 0.152: v44.04,65.53 44.65,66.14 44.81,66.14 45.72,67.06 IC1.37
JS2
  Top 0.152: IC1.36 44.2,63.25 44.2,56.84 44.81,56.24 46.02,56.24 53.65,48.62 53.65,42.67 58.67,37.64 58.67,36.88 R402.1
MAP
  Top 0.152: 10.21,1.98 13.72,1.98 14.17,2.44 R2.1 | 10.21,1.98 9.6,1.98 U2.4 | 10.21,1.98 10.21,12.5 9.3,13.41 9.3,17.22 10.06,17.98 10.06,24.69 INPUT.9
MAT
  Top 0.152: 19.36,25.76 19.36,27.89 R4.1 | 19.36,25.76 19.36,25.45 R5.1 19.36,25.76 | 19.36,25.76 16.61,25.76 C4.2 16.46,25.76 13.41,28.8 12.8,28.8 INPUT.3
N$1
  Bottom 0.152: 37.64,60.66 38.1,60.66 C24.1 37.64,60.66 | 37.64,60.66 34.29,60.66 R22.1 | 37.64,60.66 37.64,62.48 36.88,63.25 36.88,63.4 Y1.2
N$2
  Top 0.152: OK1.1 7.62,55.47 5.94,57.15 4.27,57.15 3.35,58.06 2.59,58.06 R12.2
N$4
  Bottom 0.152: C20.1 39.01,49.53 39.01,50.9 43.43,55.32 43.43,61.42 40.08,64.77 36.12,64.77 35.05,63.7 34.29,63.7 R21.1
N$5
  Top 0.152: R312.2 5.18,56.08 5.18,55.17 6.71,53.65 11.43,53.65 12.65,54.86 OK1.3
N$6
  Top 0.152: D13.A 35.66,3.66 35.66,5.18 36.73,6.25 36.73,8.53 35.66,9.6 D11.A
N$7
  Top 0.152: R16.2 60.66,41.91 60.66,41.15 64.92,36.88 64.92,35.97 IC2.1
N$8
  Top 0.152: R19.2 60.66,39.32 60.66,38.56 64.47,34.75 64.92,34.75 IC2.2
N$9
  Top 0.152: R201.1 17.83,50.6 17.83,53.65 R13.1 17.83,53.8 19.2,55.17 19.2,64.31 17.83,65.68 C11.2 17.68,65.68 16.15,65.68 15.7,66.14 9.3,66.14 OK1.8
N$10
  Top 0.152: R313.1 2.59,61.27 5.03,61.27 R301.1 5.18,61.42 9.75,61.42 12.65,64.31 OK1.6 12.8,64.31 16.46,60.66 17.68,60.66 C311.2
N$11  (via drill 0.33)
  Top 0.152: U1.4 16.31,70.71 15.7,70.71 12.65,73.76 9.14,73.76 U1.20 8.99,73.91 8.84,74.07 v7.47,74.07 | v6.55,74.98 5.33,74.98 X1.VBUS
  Bottom 0.152: v7.47,74.07 v6.55,74.98
N$14
  Top 0.152: D901.C 62.94,15.54 51.21,15.54 51.05,15.39 51.05,11.12 50.44,10.52 50.44,8.69 U$5.2
N$15
  Top 0.152: R402.2 60.66,36.73 61.27,36.73 64.47,33.53 64.92,33.53 IC2.3
N$16
  Top 0.152: U1.16 8.99,76.35 8.23,76.35 7.16,75.29 7.16,74.68 6.86,74.37 5.33,74.37 X1.D-
N$17
  Top 0.152: U1.15 8.99,77.11 6.1,77.11 4.12,75.13 4.12,74.07 4.42,73.76 5.18,73.76 X1.D+
N$18
  Top 0.152: R401.2 62.33,34.29 64.47,32.16 64.92,32.16 IC2.4
N$19
  Top 0.152: R26.2 60.66,31.7 63.25,31.7 64.01,30.94 64.92,30.94 IC2.5
N$20
  Top 0.152: R27.2 60.66,29.26 64.62,29.26 64.92,29.57 IC2.6
N$21
  Top 0.152: R29.2 62.94,26.67 64.47,28.19 64.92,28.19 IC2.7
N$22
  Top 0.152: D14.C 80.01,18.9 79.25,18.9 72.08,26.06 69.95,26.06 69.49,26.52 69.49,29.72 70.56,30.79 71.02,30.79 IC2.12
N$23
  Top 0.152: D15.C 80.01,14.63 69.19,25.45 69.19,30.63 70.1,31.55 72.24,31.55 72.39,31.39 72.39,30.33 71.78,29.72 71.17,29.72 IC2.11
N$24
  Top 0.152: D16.C 80.01,10.06 79.1,10.97 79.1,12.34 79.55,12.8 80.62,12.8 80.92,13.11 80.92,14.48 79.55,15.85 79.25,15.85 79.1,16 79.1,17.37 79.7,17.98 80.77,17.98 80.92,18.14 80.92,19.51 74.07,26.36 70.1,26.36 69.8,26.67 69.8,27.43 70.56,28.19 71.02,28.19 IC2.10
N$25
  Top 0.152: D16.A 80.01,6.55 82.45,6.55 R28.1
N$26
  Top 0.152: D15.A 80.01,11.73 82.45,11.73 R25.1
N$27
  Top 0.152: D14.A 80.01,16.76 80.62,16.76 82.45,18.59 R24.1
N$28  (via drill 0.33)
  Top 0.152: v81.99,61.42 83.06,62.48 COILA.GATE
  Bottom 0.152: v81.99,61.42 81.84,61.42 81.23,62.03 80.01,62.03 R501.2
N$30  (via drill 0.33)
  Top 0.152: v81.08,74.37 83.52,74.37 COILB.GATE
  Bottom 0.152: v81.08,74.37 79.86,74.37 R502.2
N$31
  Top 0.152: R503.2 59.44,74.83 62.94,74.83 COILC.GATE
N$32
  Top 0.152: U$5.7 50.44,2.59 51.66,2.59 U$5.8 51.82,2.59 51.82,8.53 U$5.1 51.82,8.69 51.82,8.99 54.41,11.58 63.86,11.58 69.04,6.4 70.1,6.4 R901.2
N$34
  Top 0.152: R903.2 55.47,10.21 56.39,9.3 56.39,4.42 55.47,3.5 R902.2 55.32,3.35 53.19,1.22 48.77,1.22 48.01,1.98 48.01,2.44 U$5.5
N$35
  Top 0.152: R504.2 59.44,62.18 60.2,62.18 60.81,62.79 62.79,62.79 62.94,62.94 COILD.GATE
N$36
  Top 0.152: C902.1 48.31,11.58 48.31,9.91 49.07,9.14 49.07,8.69 U$5.3
O2
  Top 0.152: 19.36,41.91 19.36,44.35 R10.1 | 19.36,41.91 17.53,41.91 12.8,37.19 INPUT.6 | 19.36,41.91 R11.2
OSC1-1
  Top 0.152: IC1.5 38.1,64.77 Y1.1
  Bottom 0.152: 41.45,60.66 41.91,60.66 C25.1 41.45,60.66 | 41.45,60.66 41.15,60.66 40.39,59.89 40.39,58.67 39.01,57.3 39.01,53.34 R23.2 | 41.45,60.66 41.45,61.57 40.39,62.64 40.23,62.64 Y1.1
OSC2-1
  Bottom 0.152: 34.29,58.67 34.29,58.06 37.19,55.17 37.19,53.34 R23.1 | 34.29,58.67 33.53,58.67 32.77,59.44 32.77,64.92 31.7,65.99 31.55,65.99 30.94,66.6 30.94,66.75 30.48,67.21 IC1.4 | 34.29,58.67 R22.2
PWM0-1  (via drill 0.33)
  Top 0.152: U$1.2 67.21,51.36 67.06,51.21 62.33,51.21 R14.1 62.18,51.05 61.11,49.99 61.11,47.24 61.42,46.94 63.09,46.94 63.25,46.79 63.25,45.26 61.87,43.89 v61.87,41.91
  Bottom 0.152: IC1.21 46.63,26.67 v61.87,41.91
PWM1-1
  Top 0.152: R17.1 62.33,48.01 66.45,48.01 67.21,48.77 U$1.4 67.36,48.92 67.97,48.31 67.97,47.7 67.67,47.4 67.67,31.85 65.99,30.18 64.01,30.18 63.86,30.33 48.62,30.33 47.55,29.26 45.72,29.26 IC1.22
RX
  Top 0.152: U1.1 16.46,68.58 18.44,66.6 18.59,66.6 28.04,57.15 28.04,46.94 30.48,44.5 IC1.13
SQUIRT-1  (via drill 0.33)
  Top 0.152: v67.36,48.01 67.36,32.77 66.14,31.55 63.86,31.55 62.64,32.77 59.74,32.77 58.83,31.85 R26.1 | v57.91,60.96 52.43,66.45 43.59,66.45 36.88,59.74 30.48,59.74 IC1.7
  Bottom 0.152: v67.36,48.01 67.36,49.07 72.08,53.8 | 72.08,53.8 78.18,59.89 79.7,59.89 80.01,60.2 R501.1 | v57.91,60.96 60.5,58.37 60.5,54.56 61.27,53.8 72.08,53.8
TACH
  Top 0.152: OUTPUT.11 87.63,16.92 84.73,19.81 84.73,21.64 82.6,23.77 R403.2 82.45,23.93 77.88,23.93 75.13,26.67 75.13,29.11 72.24,32 71.17,32 IC2.13
TPS
  Top 0.152: R9.1 19.36,39.32 19.05,39.01 16.61,39.01 C8.2 16.46,38.86 15.85,38.25 15.7,38.25 12.8,35.36 12.8,34.44 INPUT.5
TX
  Top 0.152: U1.5 16.46,71.17 17.07,71.17 28.35,59.89 28.35,49.23 30.48,47.09 IC1.12
V12
  Top 0.152: 46.02,13.11 45.72,12.8 D10.A | 46.02,13.11 47.7,14.78 47.7,16.31 C15.2 | 41.76,23.47 41.76,17.37 46.02,13.11 | 41.76,23.47 41.76,30.02 42.06,30.33 46.18,30.33 48.62,32.77 58.98,32.77 59.74,33.53 59.74,35.05 59.44,35.36 58.37,35.36 55.32,38.41 49.53,38.41 R3.1 | 46.02,13.11 D10.A | 41.76,23.47 12.8,23.47 INPUT.1 | D10.A D11.C
VCC  (via drill 0.33)
  Top 0.152: R903.1 55.32,8.53 54.25,9.6 54.25,10.97 54.56,11.28 56.24,11.28 56.84,10.67 56.84,7.92 59.59,5.18 L3.2 | v60.81,51.51 60.81,47.09 61.72,46.18 62.18,46.18 R17.2 | v60.81,52.73 62.03,52.73 62.18,52.88 R14.2 62.33,53.03 62.64,53.34 68.43,53.34 71.48,50.29 | 71.48,50.29 72.39,50.29 U$1.6 71.48,50.29 | R24.2 82.6,16.76 82.6,13.72 R25.2 82.6,13.56 83.67,12.5 83.67,11.12 82.6,10.06 82.6,8.69 R28.2 82.45,8.53 81.53,8.53 80.77,7.77 73.46,7.77 73.3,7.92 | 73.3,7.92 71.17,10.06 C903.+ 71.02,10.21 71.02,11.89 66.45,16.46 C18.2 66.45,16.61 66.45,18.75 64.92,20.27 C17.+ 64.77,20.42 62.33,22.86 62.33,24.08 D19.C 62.33,24.23 64.31,24.23 68.28,28.19 68.28,30.94 70.1,32.77 72.24,32.77 74.07,30.94 74.83,30.94 75.13,31.24 75.13,31.85 73,33.98 73,36.58 71.02,38.56 71.02,49.23 71.48,49.68 71.48,50.29 | 59.74,4.42 59.74,5.03 L3.2 | 59.74,4.42 63.09,1.07 70.56,1.07 73.3,3.81 73.3,7.92 | R12.1 2.44,56.24 1.52,57.15 1.52,58.83 1.68,58.98 4.27,58.98 5.03,58.22 R312.1 5.18,58.06 14.33,58.06 16.76,55.63 | 16.76,55.63 17.68,55.63 R13.2 17.83,55.63 18.9,56.69 18.9,61.27 18.59,61.57 16,61.57 14.17,63.4 14.17,65.23 13.56,65.84 11.89,65.84 11.58,65.53 11.58,63.7 10.97,63.09 6.86,63.09 6.55,63.4 6.55,63.55 5.94,64.16 4.27,64.16 3.35,63.25 2.59,63.25 R313.2 | L2.1 28.04,16.61 31.7,16.61 L1.1 31.85,16.46 31.85,14.78 35.05,11.58 35.2,11.58 45.87,0.91 54.71,0.91 58.22,4.42 59.74,4.42 | C1.1 34.29,26.98 30.79,26.98 IC1.20 28.19,24.38 16.15,24.38 14.48,26.06 12.8,26.06 INPUT.2 | 16.76,55.63 16.76,42.52 12.5,38.25 12.34,38.25 11.58,37.49 11.58,33.98 12.8,32.77 13.11,32.77 14.02,31.85 v14.02,31.24
  Top 0.152: 59.74,4.42 L3.2
  Bottom 0.152: v60.81,52.73 v60.81,51.51 | IC1.20 30.48,26.06 31.85,24.69 31.85,16.61 L1.1 | v14.02,31.24 14.17,31.09 14.17,27.58 12.8,26.21 INPUT.2
VREF
  Top 0.152: 17.07,3.81 17.07,4.12 16.15,5.03 C3.2 | 17.07,3.81 17.07,1.68 16.31,0.91 7.92,0.91 7.01,1.83 U2.2 7.01,1.98 7.01,9.14 8.84,10.97 8.84,24.99 10.36,26.52 10.67,26.52 11.58,27.43 11.58,29.26 12.34,30.02 19.2,30.02 21.18,28.04 R4.2 21.34,28.04 22.86,28.04 24.84,30.02 26.82,30.02 30.18,33.38 31.39,33.38 32,33.98 32,34.59 | C23.2 23.32,16.46 23.32,13.56 24.08,12.8 C22.+ 24.23,12.65 27.89,8.99 27.89,3.81 | 27.89,3.81 17.07,3.81 | 27.89,3.81 L2.2 | 32,34.59 31.39,35.2 28.96,35.2 24.38,30.63 20.57,30.63 20.27,30.94 20.27,33.38 21.18,34.29 R7.2 | IC1.31 45.72,51.36 47.55,49.53 47.55,43.89 46.48,42.82 44.81,42.82 44.2,42.22 44.2,41.6 45.57,40.23 46.79,40.23 47.24,39.78 47.24,36.42 46.02,35.2 32.61,35.2 32,34.59
VREG_12IN
  Top 0.152: C901.+ 69.95,3.35 71.93,5.33 71.93,6.25 R901.1 71.93,6.4 69.04,9.3 66.6,9.3 64.01,11.89 52.58,11.89 | 47.85,4.42 45.72,6.55 D12.C 45.72,6.71 39.78,12.65 35.66,12.65 D10.C | 47.85,4.42 49.07,3.2 49.07,2.59 U$5.6 | 52.58,11.89 52.58,11.28 51.05,9.75 51.05,7.62 47.85,4.42 | 52.58,11.89 C16.+
VSYN
  Top 0.152: L1.2 44.5,16.61 46.02,18.14 46.02,21.49 C19.2 46.02,21.64 49.68,25.3 64.92,25.3 67.97,28.35 67.97,38.71 68.58,39.32 68.58,51.97 68.43,52.12 60.5,52.12 60.2,52.43 60.2,53.03 60.5,53.34 60.5,60.96 60.2,61.27 58.52,61.27 51.51,68.28 45.41,68.28 38.86,74.83 30.48,74.83 IC1.1
WARMUP-1  (via drill 0.33)
  Top 0.152: v43.28,29.72 44.65,28.35 47.09,28.35 47.85,29.11 58.67,29.11 R27.1 | v32.16,56.39 32.16,57.3 31.39,58.06 30.18,58.06 28.96,59.28 28.96,75.29 29.57,75.89 46.63,75.89 49.53,73 59.44,73 R503.1
  Bottom 0.152: v43.28,29.72 43.28,41 32.46,51.82 32.46,52.58 31.7,53.34 31.09,53.34 30.48,53.95 IC1.9 30.48,54.86 31.39,55.78 31.55,55.78 v32.16,56.39

### Text on the board
tNames: PCB Rev 3.1 | FT232 | DietSquirt | DietSquirt | PCB Rev 3 | DietSquirt | 34063 | MAP | L / 3
bNames: INPUT: / 1 - +12v In / 2 - +5v Out / 3 - Air Temp / 4 - Coolant / 5 - TPS / 6 - O2 / 7 - CAM / 8 - Crank / 9 - MAP / 10-15 Logic GND | OUTPUT: / 1 - INJ Ch1 / 2 - INJ Ch2 / 5 - Coil A / 6 - Coil B / 7 - Coil C / 8 - Coil D / 9 - Fuel Pump / 10 - Rad Fan / 11 - Tach Out / 12 - Idle Ctl / 14-25 High Current GND | Designed by: aNoNyMouS / We are Legion!